# Altium project isg_adc_dac_prototyping_board.PrjPcb
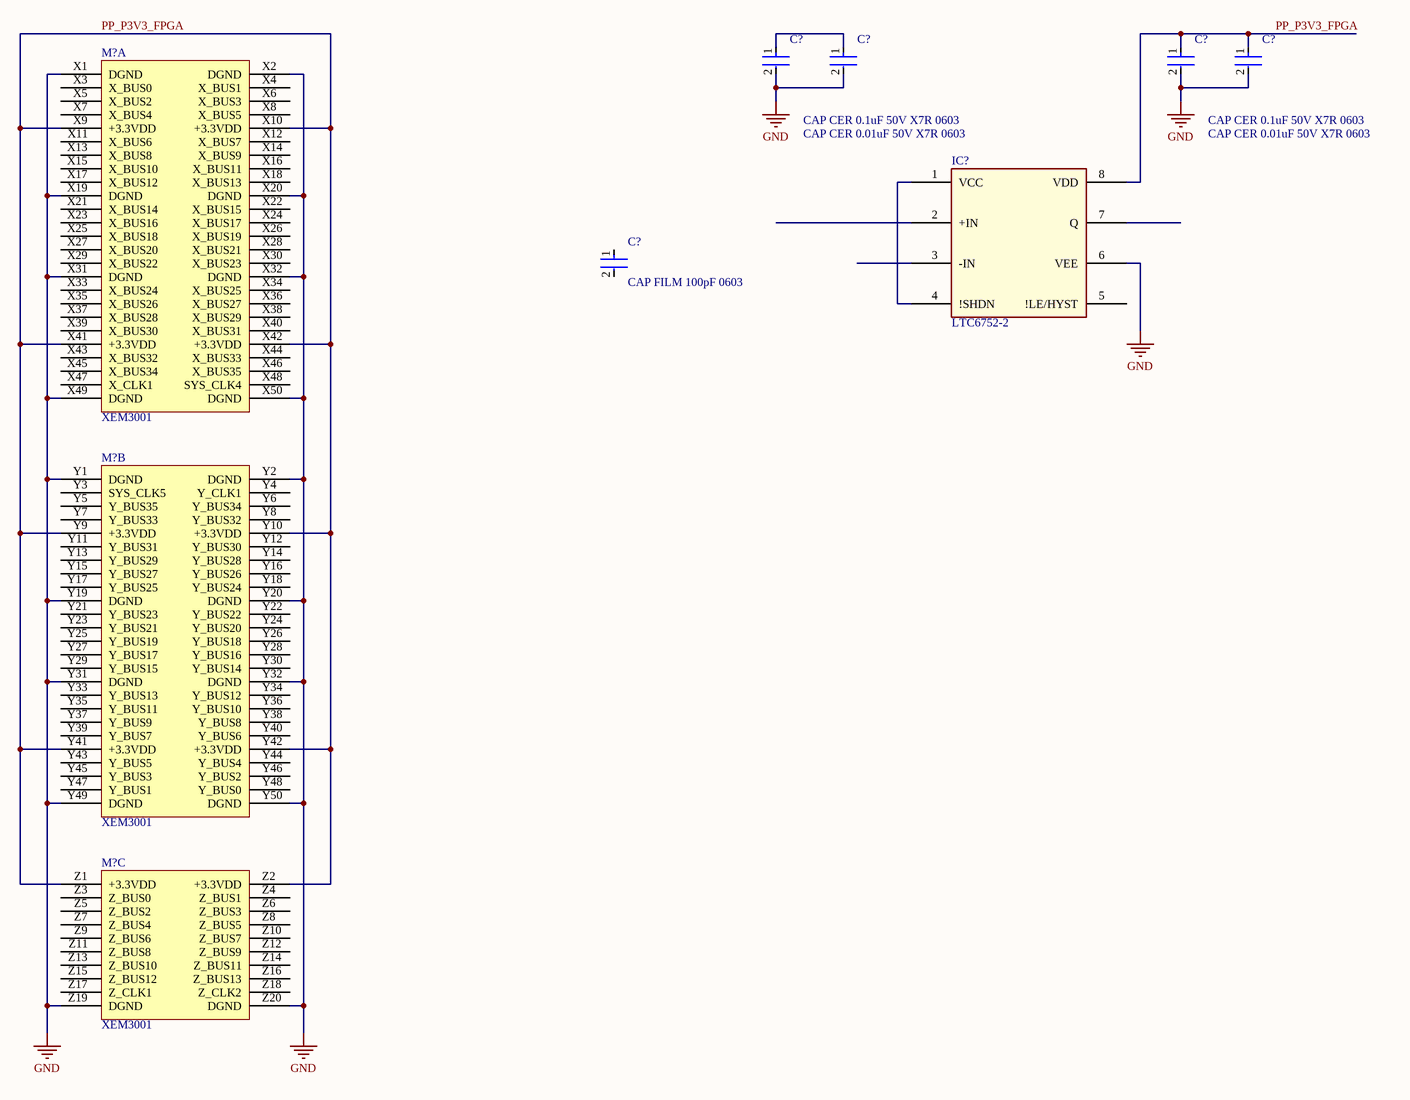
[diagram p0: isg_adc_dac_prototyping_board.SchDoc]
1 sheet, 9 parts. Net scope: global (net labels, ports and power ports of the same name join across sheets).

## Sheet isg_adc_dac_prototyping_board.SchDoc
size B

### Parts
(Parts that share a designator on the sheet are numbered #1, #2 ... from top to bottom, then left to right.)
C?#1  CAP CER 0.1uF 50V X7R 0603  [FP-CC0603-DA-MFG]
C?#2  CAP CER 0.01uF 50V X7R 0603  [FP-CC0603-DA-MFG]
C?#3  CAP CER 0.1uF 50V X7R 0603  [FP-CC0603-DA-MFG]
C?#4  CAP CER 0.01uF 50V X7R 0603  [FP-CC0603-DA-MFG]
C?#5  CAP FILM 100pF 0603  [FP-CC0603-DA-MFG]
IC?  LTC6752-2  [MSOP8]
M?#1  XEM3001  [XEM3001MODULE]  (part A of 3)
M?#2  XEM3001  [XEM3001MODULE]  (part B of 3)
M?#3  XEM3001  [XEM3001MODULE]  (part C of 3)

### Nets
GND: C?#1.2 C?#2.2 C?#3.2 C?#4.2 IC?.6(VEE) M?#1.X1(DGND) M?#1.X2(DGND) M?#1.X19(DGND) M?#1.X20(DGND) M?#1.X31(DGND) M?#1.X32(DGND) M?#1.X49(DGND) M?#1.X50(DGND) M?#2.Y1(DGND) M?#2.Y2(DGND) M?#2.Y19(DGND) M?#2.Y20(DGND) M?#2.Y31(DGND) M?#2.Y32(DGND) M?#2.Y49(DGND) M?#2.Y50(DGND) M?#3.Z19(DGND) M?#3.Z20(DGND)
PP_P3V3_FPGA: C?#3.1 C?#4.1 IC?.8(VDD) M?#1.X9(+3.3VDD) M?#1.X10(+3.3VDD) M?#1.X41(+3.3VDD) M?#1.X42(+3.3VDD) M?#2.Y9(+3.3VDD) M?#2.Y10(+3.3VDD) M?#2.Y41(+3.3VDD) M?#2.Y42(+3.3VDD) M?#3.Z1(+3.3VDD) M?#3.Z2(+3.3VDD)
NetC?#1_1: C?#1.1 C?#2.1
NetIC?_1: IC?.1(VCC) IC?.4(!SHDN)

Not connected (* = marked no-connect by the designer): C?#5 1 2; IC? 2(+IN) 3(-IN) 5(!LE/HYST) 7(Q); M?#1 X3(X_BUS0) X4(X_BUS1) X5(X_BUS2) X6(X_BUS3) X7(X_BUS4) X8(X_BUS5) X11(X_BUS6) X12(X_BUS7) X13(X_BUS8) X14(X_BUS9) X15(X_BUS10) X16(X_BUS11) X17(X_BUS12) X18(X_BUS13) X21(X_BUS14) X22(X_BUS15) X23(X_BUS16) X24(X_BUS17) X25(X_BUS18) X26(X_BUS19) X27(X_BUS20) X28(X_BUS21) X29(X_BUS22) X30(X_BUS23) X33(X_BUS24) X34(X_BUS25) X35(X_BUS26) X36(X_BUS27) X37(X_BUS28) X38(X_BUS29) X39(X_BUS30) X40(X_BUS31) X43(X_BUS32) X44(X_BUS33) X45(X_BUS34) X46(X_BUS35) X47(X_CLK1) X48(SYS_CLK4); M?#2 Y3(SYS_CLK5) Y4(Y_CLK1) Y5(Y_BUS35) Y6(Y_BUS34) Y7(Y_BUS33) Y8(Y_BUS32) Y11(Y_BUS31) Y12(Y_BUS30) Y13(Y_BUS29) Y14(Y_BUS28) Y15(Y_BUS27) Y16(Y_BUS26) Y17(Y_BUS25) Y18(Y_BUS24) Y21(Y_BUS23) Y22(Y_BUS22) Y23(Y_BUS21) Y24(Y_BUS20) Y25(Y_BUS19) Y26(Y_BUS18) Y27(Y_BUS17) Y28(Y_BUS16) Y29(Y_BUS15) Y30(Y_BUS14) Y33(Y_BUS13) Y34(Y_BUS12) Y35(Y_BUS11) Y36(Y_BUS10) Y37(Y_BUS9) Y38(Y_BUS8) Y39(Y_BUS7) Y40(Y_BUS6) Y43(Y_BUS5) Y44(Y_BUS4) Y45(Y_BUS3) Y46(Y_BUS2) Y47(Y_BUS1) Y48(Y_BUS0); M?#3 Z3(Z_BUS0) Z4(Z_BUS1) Z5(Z_BUS2) Z6(Z_BUS3) Z7(Z_BUS4) Z8(Z_BUS5) Z9(Z_BUS6) Z10(Z_BUS7) Z11(Z_BUS8) Z12(Z_BUS9) Z13(Z_BUS10) Z14(Z_BUS11) Z15(Z_BUS12) Z16(Z_BUS13) Z17(Z_CLK1) Z18(Z_CLK2)

### Library data of the parts
C?#1-C?#4 = CMP-03422-000030-1: Manufacturer Part Number: CC0603KRX7R7BB104; Manufacturer: YAGEO; Voltage Rating: 16 V; Tolerance: 0.1; Value: 100 nF; Temperature Coefficient: 15%; Material: Ceramic; Package: CC0603-DA; ComponentLink2Description: Datasheet; Octopart: https://octopart.com/cc0603krx7r7bb104-yageo-192941; Temperature Range High: +125°C; Digikey Description: CAP CER 0.1UF 16V X7R 0603; Voltage: 16 V; Device Class L2: Capacitors; Height: 0.9mm; Temperature: -55°C to +125°C; Device Class L1: Passive Components; Device Class L3: Ceramic Capacitors; ComponentLink2URL: http://www.yageo.com/documents/recent/UPY-GPHC_X7R_6.3V-to-50V_18.pdf; Footprint Url: http://www.yageo.com/exep/pages/download/literatures/UPY-C_GEN_24.pdf; RoHS: TRUE; Temperature Range Low: -55°C; Temperature Characteristic: X7R; Lead Free: Yes; Capacitance: 100 nF; Category: Cap; Mouser Description: Multilayer Ceramic Capacitor, CC Series, 0.1 - F, - 10%, X7R, 16 V, 0603 [1608 Metric]; Automotive: No
C?#5 = CMP-03422-000030-1: Manufacturer Part Number: CC0603KRX7R7BB104; Manufacturer: YAGEO; Voltage Rating: 16 V; Tolerance: 0.1; Value: 100 nF; Temperature Coefficient: 15%; Temperature Characteristic: X7R; Material: Ceramic; Package: CC0603-DA; ComponentLink2Description: Datasheet; Octopart: https://octopart.com/cc0603krx7r7bb104-yageo-192941; Temperature Range High: +125°C; Digikey Description: CAP CER 0.1UF 16V X7R 0603; Voltage: 16 V; Device Class L2: Capacitors; Height: 0.9mm; Temperature: -55°C to +125°C; Device Class L1: Passive Components; Device Class L3: Ceramic Capacitors; ComponentLink2URL: http://www.yageo.com/documents/recent/UPY-GPHC_X7R_6.3V-to-50V_18.pdf; Footprint Url: http://www.yageo.com/exep/pages/download/literatures/UPY-C_GEN_24.pdf; RoHS: TRUE; Temperature Range Low: -55°C; Lead Free: Yes; Capacitance: 100 nF; Category: Cap; Mouser Description: Multilayer Ceramic Capacitor, CC Series, 0.1 - F, - 10%, X7R, 16 V, 0603 [1608 Metric]; Automotive: No
M?#1-M?#3 = XEM3001: XEM3001 Module Connector; Manufacturer: Generic Components; Revision: 20040624; Publisher: Opal Kelly; Class I: Connector